# EAGLE design FlukeNic_UNITA (EAGLE 7.7.0)
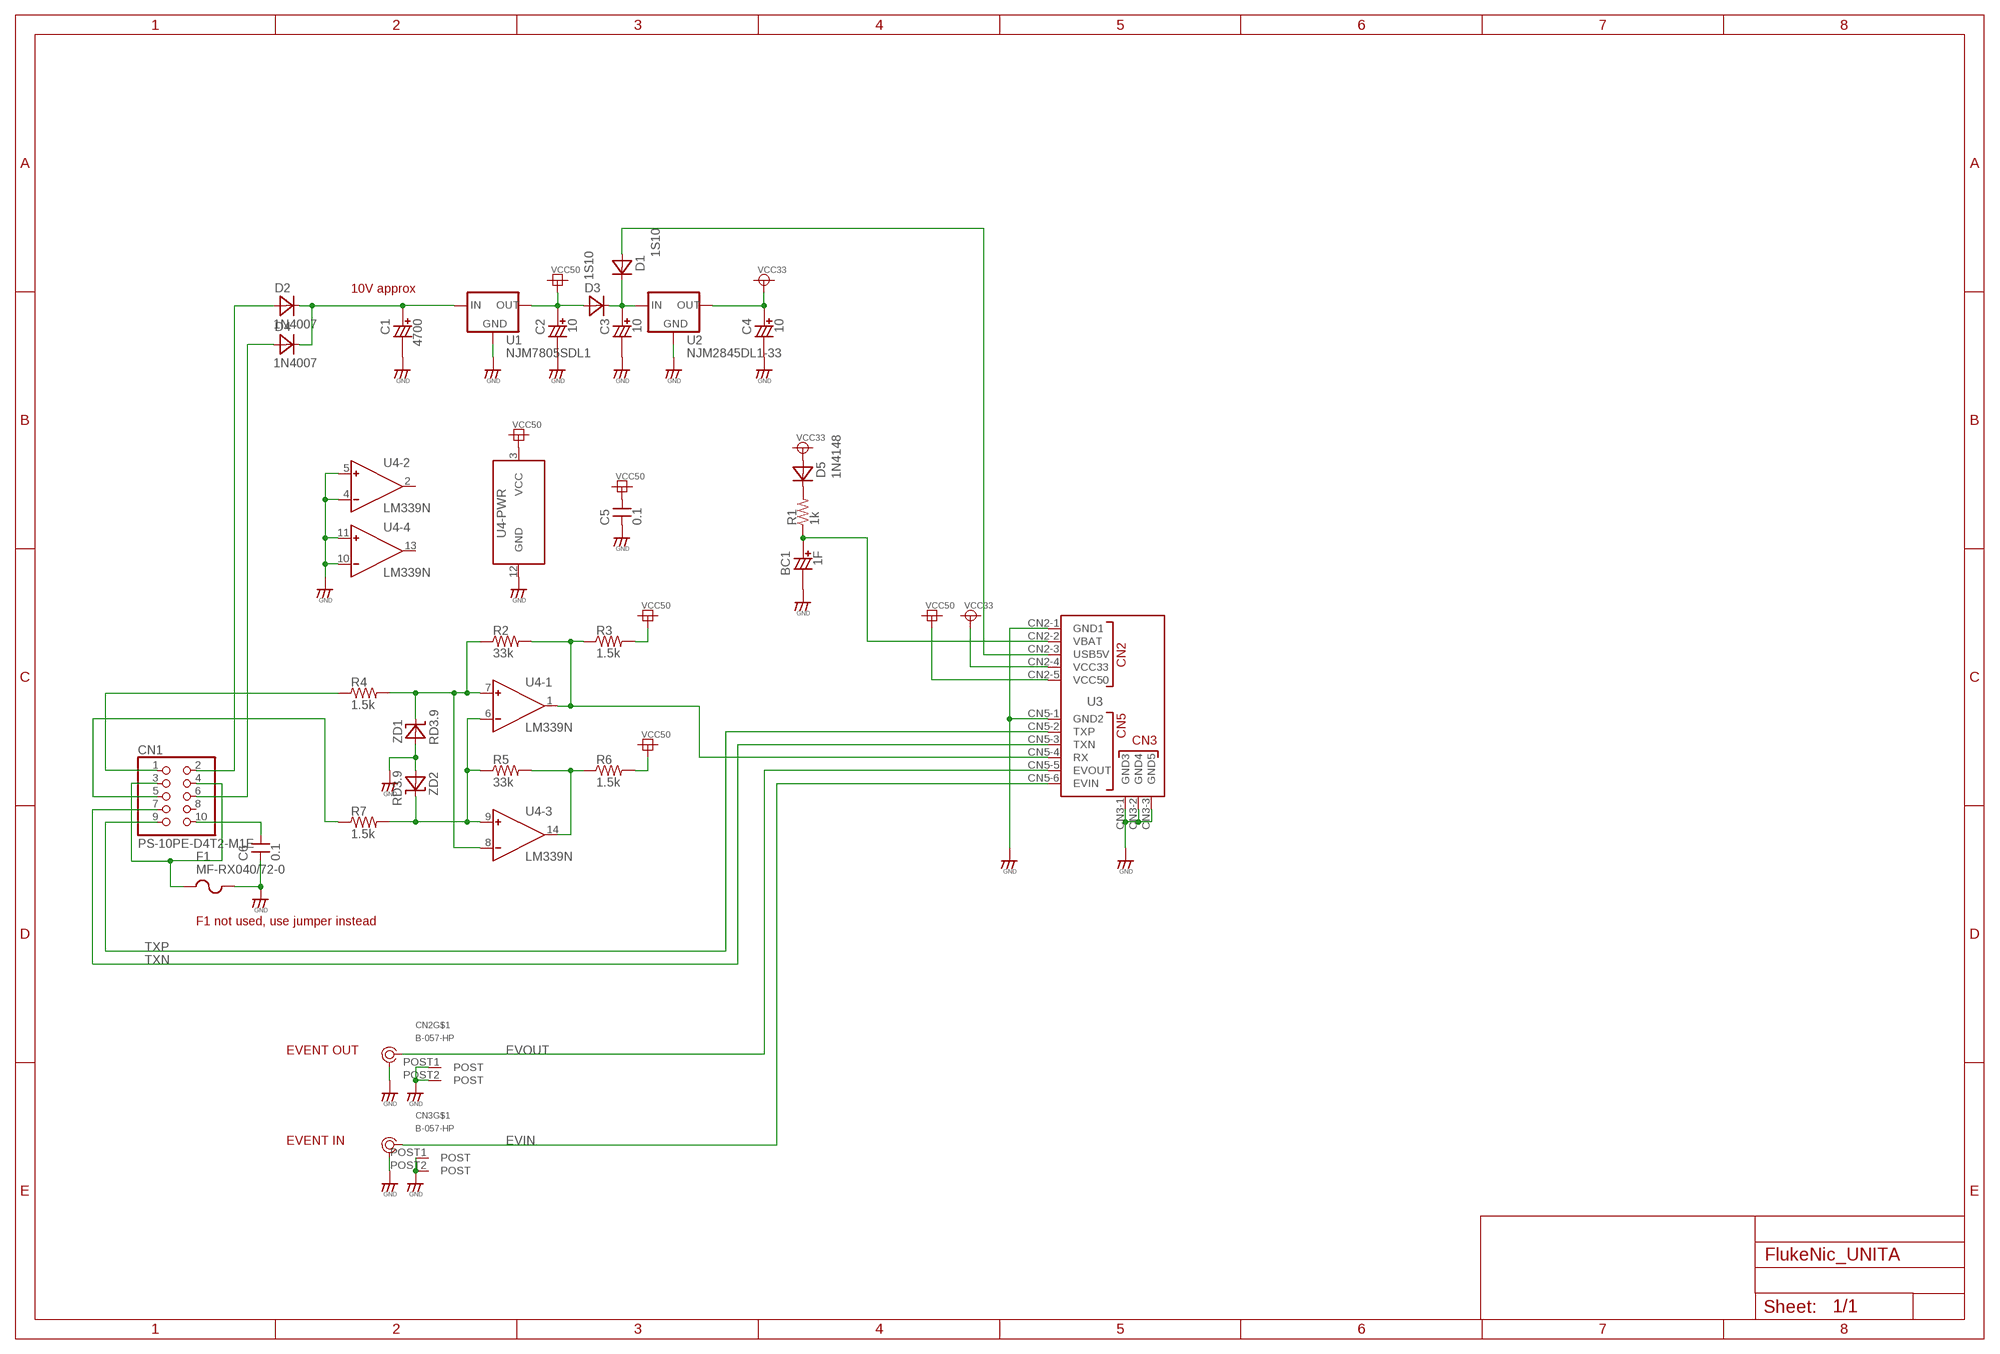
[diagram p0: schematic, sheet 1]

## Parts
BC1  1F  EDLCSE-5R5-D105VY  [SE-5R5-D105VY]
C1  4700  CCAP16  [CCAP_16]
C2  10  CCAP6.5  [CCAP_6.5]
C3  10  CCAP6.5  [CCAP_6.5]
C4  10  CCAP6.5  [CCAP_6.5]
C5  0.1  CAPDIP_2  [CAP_DIP_2]
C6  0.1  CAPDIP_2  [CAP_DIP_2]
CN1  PS-10PE-D4T2-M1E  [PS-10PE-D4T2-M1E]
CN2  B-057-HP  [B-057-HP]
CN3  B-057-HP  [B-057-HP]
D1  1S10  DIODEGENERIC_4_1MM  [DIODE_4_1MM]
D2  1N4007  DIODEGENERIC_4_1MM  [DIODE_4_1MM]
D3  1S10  DIODEGENERIC_4_1MM  [DIODE_4_1MM]
D4  1N4007  DIODEGENERIC_4_1MM  [DIODE_4_1MM]
D5  1N4148  DIODEGENERIC_4  [DIODE_4]
F1  MF-RX040/72-0  POLYSW8X2MM  [AX_08X02_2P_200]
R1  1k  R0.25W_4P  [R_0.25W_4]
R2  33k  R0.25W_4P  [R_0.25W_4]
R3  1.5k  R0.25W_4P  [R_0.25W_4]
R4  1.5k  R0.25W_4P  [R_0.25W_4]
R5  33k  R0.25W_4P  [R_0.25W_4]
R6  1.5k  R0.25W_4P  [R_0.25W_4]
R7  1.5k  R0.25W_4P  [R_0.25W_4]
U1  NJM7805SDL1  78XXTO252  [TO252]
U2  NJM2845DL1-33  NJM2845  [TO252]
U3  UNITB  [UNITB]
U4  LM339N  [DIL14]
ZD1  RD3.9  ZENER_DIODE4  [DIODE_4]
ZD2  RD3.9  ZENER_DIODE4  [DIODE_4]

## Nets
EVIN: CN3.HOT U3.CN5-6(EVIN)
EVOUT: CN2.HOT U3.CN5-5(EVOUT)
GND: BC1.- C1.- C2.- C3.- C4.- C5.1 C6.1 CN2.COLD CN2.POST1(POST) CN2.POST2(POST) CN3.COLD CN3.POST1(POST) CN3.POST2(POST) F1.2 U1.2(GND) U2.2(GND) U3.CN2-1(GND1) U3.CN3-1(GND3) U3.CN3-2(GND4) U3.CN3-3(GND5) U3.CN5-1(GND2) U4.4(-2:IN-) U4.5(-2:IN+) U4.10(-4:IN-) U4.11(-4:IN+) U4.12(-PWR:GND) ZD1.A ZD2.A
N$2: R2.1 R4.2 U4.7(-1:IN+) U4.8(-3:IN-) ZD1.K
N$4: R5.1 R7.2 U4.6(-1:IN-) U4.9(-3:IN+) ZD2.K
N$6: R5.2 R6.1 U4.14(-3:OUT)
N$7: D5.K R1.2
N$9: CN1.3 CN1.4 F1.1
N$12: C1.+ D2.K D4.K U1.1(IN)
N$20: CN1.2 D2.A
N$21: CN1.6 D4.A
N$29: C3.+ D1.K D3.K U2.1(IN)
N$37: C6.2 CN1.10
RX: R2.2 R3.1 U3.CN5-4(RX) U4.1(-1:OUT)
RXN: CN1.5 R7.1
RXP: CN1.1 R4.1
TXN: CN1.7 U3.CN5-3(TXN)
TXP: CN1.9 U3.CN5-2(TXP)
USB5V: D1.A U3.CN2-3(USB5V)
VBAT: BC1.+ R1.1 U3.CN2-2(VBAT)
VCC33: C4.+ D5.A U2.3(OUT) U3.CN2-4(VCC33)
VCC50: C2.+ C5.2 D3.A R3.2 R6.2 U1.3(OUT) U3.CN2-5(VCC50) U4.3(-PWR:VCC)
Unconnected: CN1.8 U4.2(-2:OUT) U4.13(-4:OUT)

## Notes on the sheet
- 10V approx
- F1 not used, use jumper instead
- EVENT OUT
- EVENT IN

## Library data of the parts
BC1 = FlukeNic:EDLC
C1-C4 = FlukeNic:CCAP: Polar capacitor
C5 C6 = FlukeNic:CAP: Non polar capacitor
CN1 = FlukeNic:PS-10PE-D4T2-M1E
CN2 CN3 = FlukeNic:B-057-HP
D1-D5 = FlukeNic:DIODE
F1 = FlukeNic:POLYSW
R1-R7 = FlukeNic:R
U1 = FlukeNic:78XX
U2 = FlukeNic:NJM2845
U3 = FlukeNic:UNITB
U4 = FlukeNic:LM339
ZD1 ZD2 = FlukeNic:ZENER_DIODE

## Board
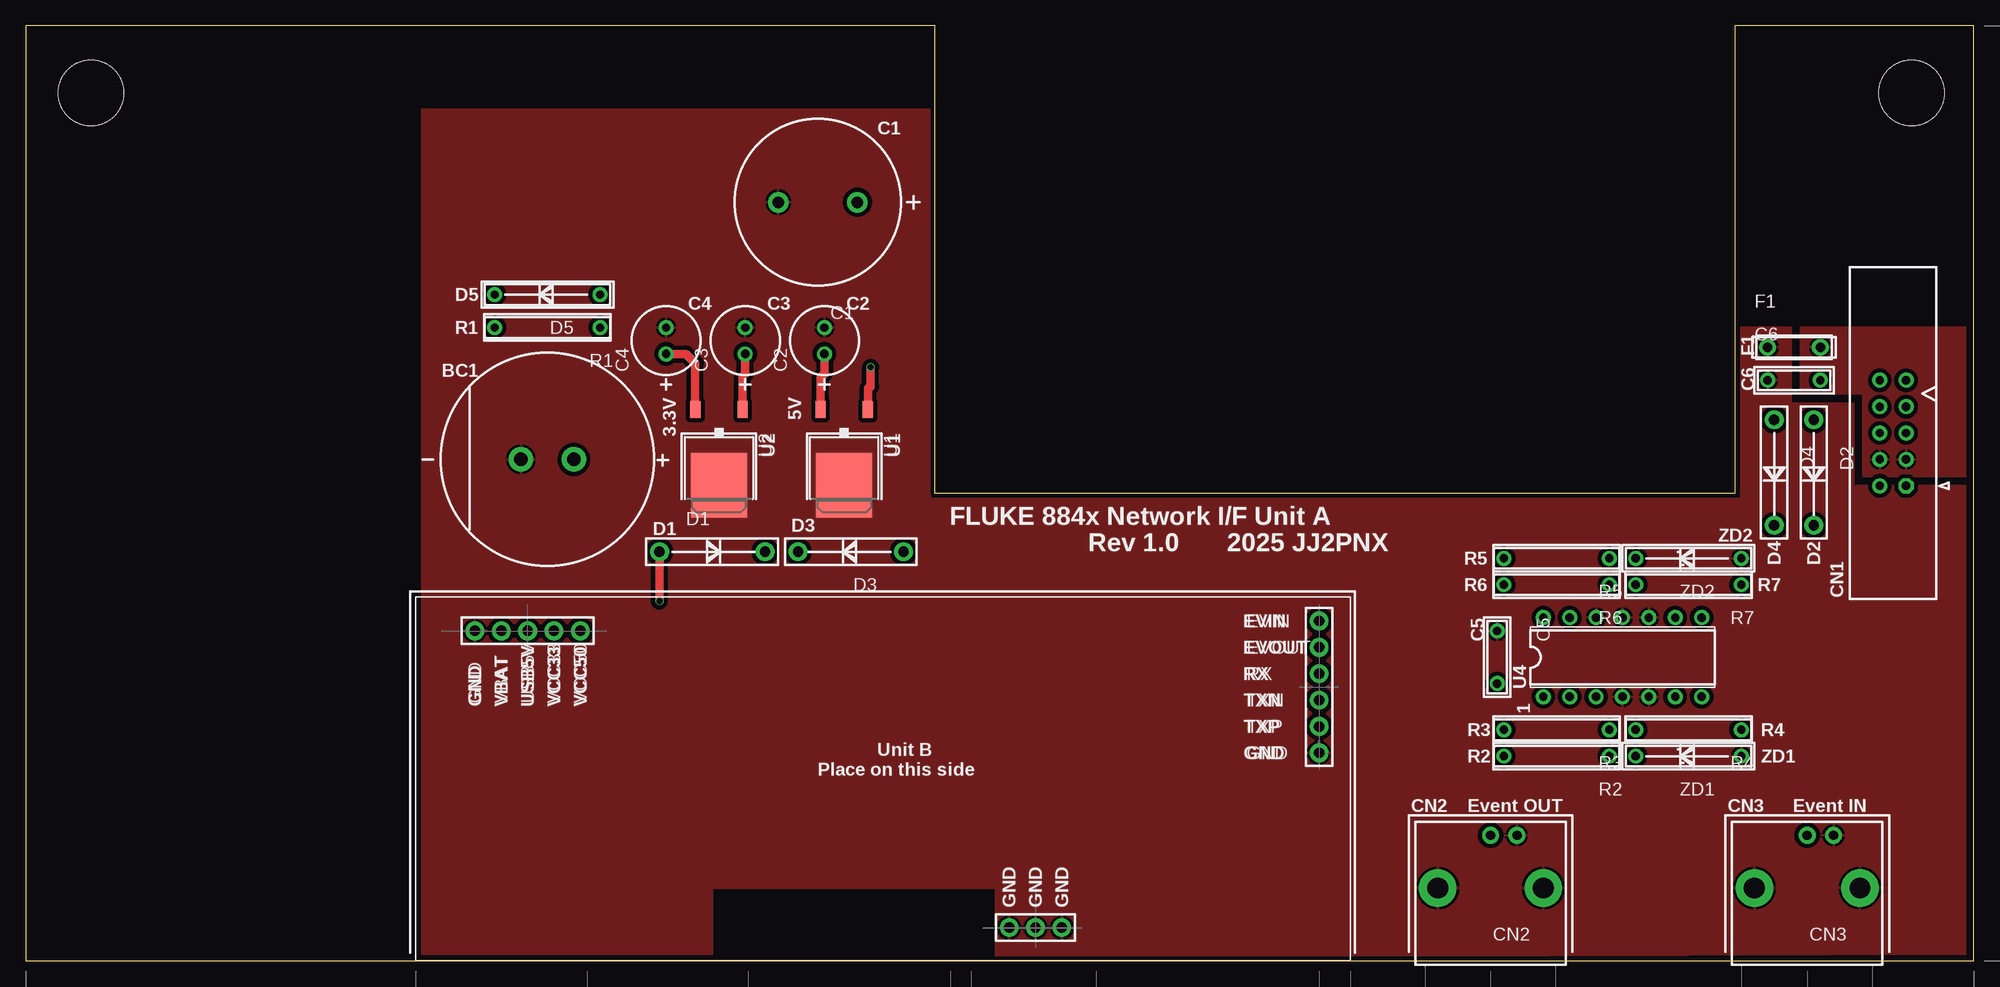
[diagram p1: board, top side]
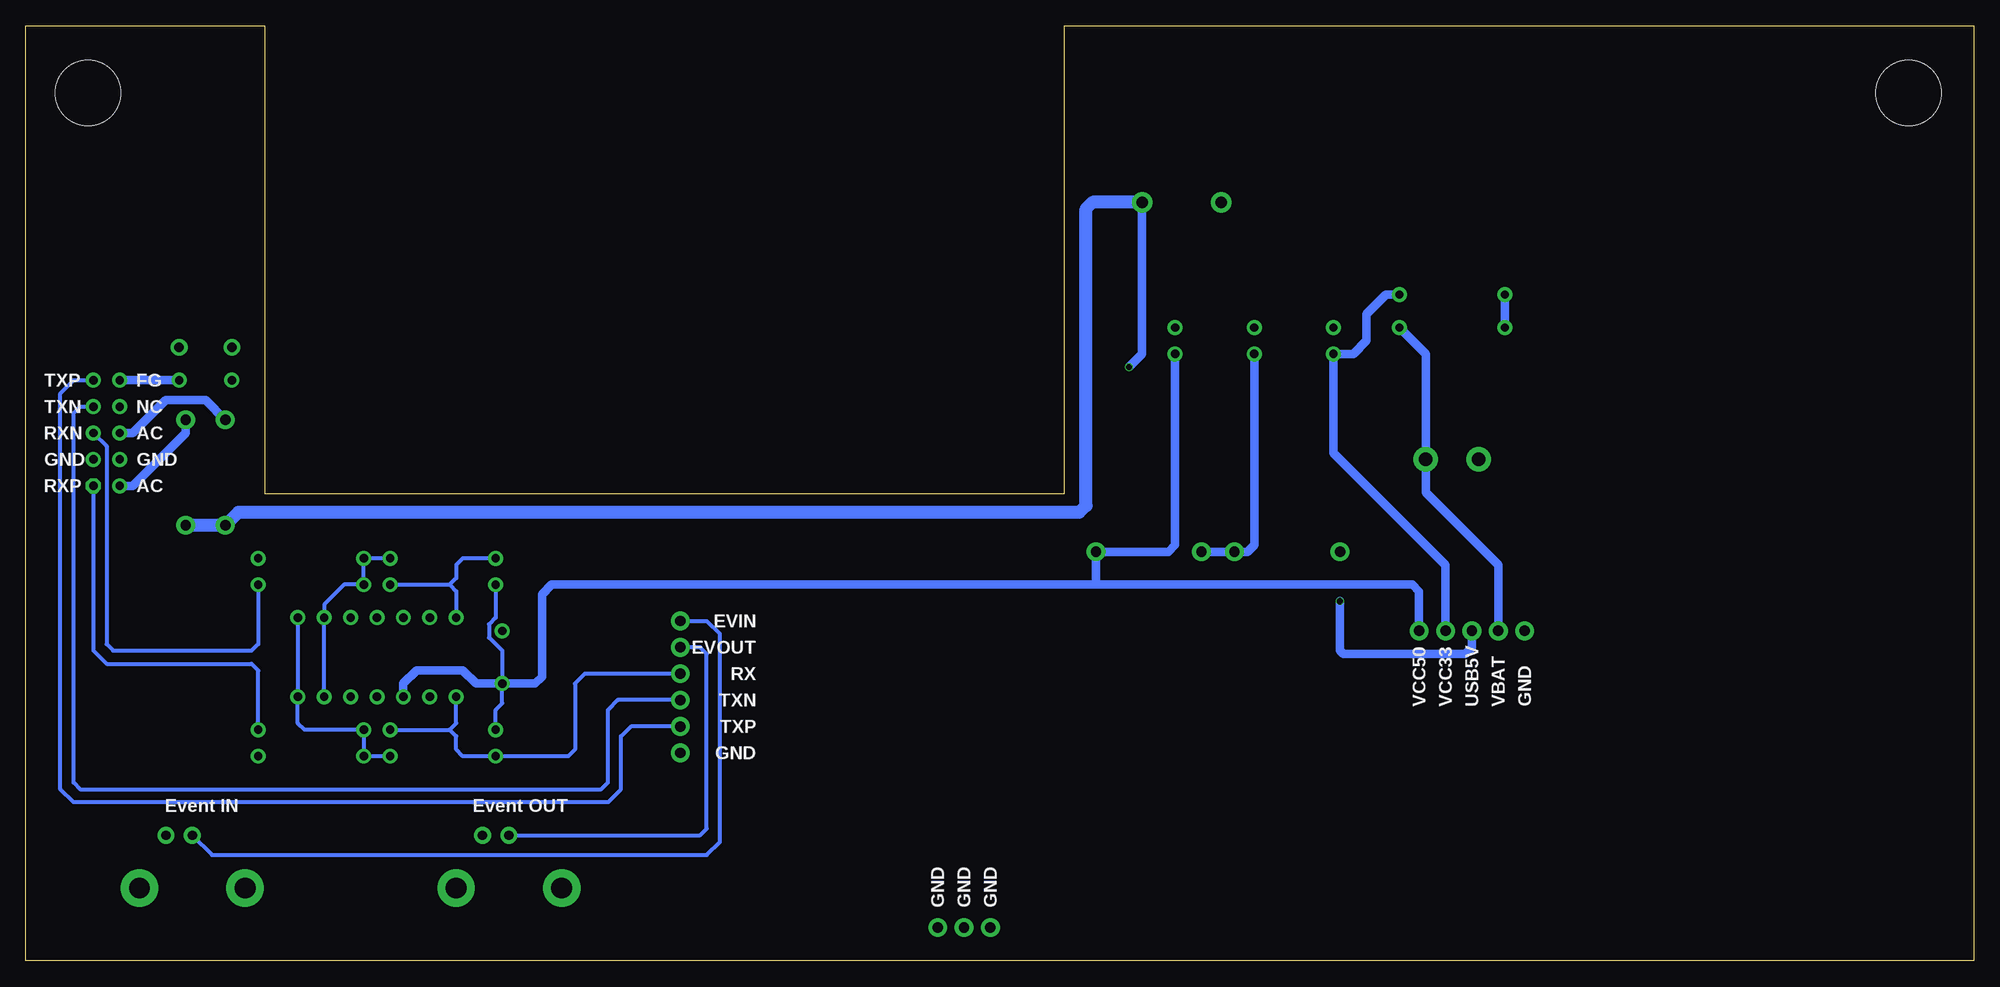
[diagram p2: board, bottom side, seen from below]

Size 187.5 x 90 mm. Coordinates in mm from the lower left corner, seen from the top.
Outline: 0,0 187.5,0 187.5,90 164.5,90 164.5,45 87.5,45 87.5,90 0,90 0,0
Copper layers (1*16): Top 0.035mm / dielectric 1.6mm / Bottom 0.035mm
Design rules "jlcpcb-2layers *": minimum track width 5mil, minimum drill 0.3mm, track to track 5mil, track to pad 5mil, pad to pad 5mil, via to via 5mil, smd to smd 5mil, copper to edge 0.2mm, drill to drill 6mil, minimum pad ring 10mil, minimum via ring 3mil, stop-mask expansion 4mil, vias tented up to drill 0mil, thermal gap 10mil
Holes 6.3 mm at 181.52,83.57 6.26,83.57
bRestrict: area 67.5,0 to 91,8.5

### Footprints (pad centres in the part's own frame; a part is rotated, then mirrored left to right if it is on the bottom)
SE-5R5-D105VY = drill 1.3: + -2.54,0; - 2.54,0
CCAP_16 = drill 1.1: + -3.81,0; - 3.81,0
CCAP_6.5 = drill 0.8: + -1.27,0; - 1.27,0
CAP_DIP_2 = drill 0.8: 1 -2.54,0; 2 2.54,0
PS-10PE-D4T2-M1E = drill 0.8 octagon: 1 5.08,1.27 | drill 0.8: 2 5.08,-1.27; 3 2.54,1.27; 4 2.54,-1.27; 5 0,1.27; 6 0,-1.27; 7 -2.54,1.27; 8 -2.54,-1.27; 9 -5.08,1.27; 10 -5.08,-1.27
B-057-HP = drill 0.9: COLD -2.54,-5.08; HOT 0,-5.08 | drill 2: POST1 -5.08,0; POST2 5.08,0
DIODE_4_1MM = drill 1: A -5.08,0; K 5.08,0
DIODE_4 = drill 0.8: A -5.08,0; K 5.08,0
AX_08X02_2P_200 = drill 0.9: 1 2.54,0; 2 -2.54,0
R_0.25W_4 = drill 0.8: 1 -5.08,0; 2 5.08,0
TO252 = smd 1 x 1.6: 1 -2.28,-4.8; 3 2.28,-4.8 | smd 5.4 x 6.2: 2 0,2.5
UNITB = drill 1: CN2-1 5.715,31.75; CN2-2 8.255,31.75; CN2-3 10.795,31.75; CN2-4 13.335,31.75; CN2-5 15.875,31.75; CN3-1 57.15,3.175; CN3-2 59.69,3.175; CN3-3 62.23,3.175; CN5-1 86.995,20.003; CN5-2 86.995,22.543; CN5-3 86.995,25.082; CN5-4 86.995,27.622; CN5-5 86.995,30.163; CN5-6 86.995,32.703
DIL14 = drill 0.8: 1 -7.62,-3.81; 2 -5.08,-3.81; 3 -2.54,-3.81; 4 0,-3.81; 5 2.54,-3.81; 6 5.08,-3.81; 7 7.62,-3.81; 8 7.62,3.81; 9 5.08,3.81; 10 2.54,3.81; 11 0,3.81; 12 -2.54,3.81; 13 -5.08,3.81; 14 -7.62,3.81

### Placement (x,y rotation side)
BC1  50.2,48.26 180 top
C1  76.23,73.03 180 top
C2  76.87,59.69 90 top
C3  69.25,59.69 90 top
C4  61.63,59.69 90 top
C5  141.64,29.21 270 top
C6  170.22,55.88 0 top
CN1  179.74,50.8 270 top
CN2  141,6.99 180 top
CN3  171.49,6.99 180 top
D1  66.08,39.37 0 top
D2  172.12,46.99 270 top
D3  79.41,39.37 180 top
D4  168.31,46.99 270 top
D5  50.2,64.14 180 top
F1  170.22,59.05 0 top
R1  50.2,60.96 180 top
R2  147.36,19.68 180 top
R3  147.36,22.23 180 top
R4  160.06,22.23 180 top
R5  147.36,38.73 180 top
R6  147.36,36.2 180 top
R7  160.06,36.2 180 top
U1  78.78,48.26 180 top
U2  66.71,48.26 180 top
U3  37.5,0 0 top
U4  153.7,29.21 0 top
ZD1  160.06,19.68 180 top
ZD2  160.06,38.73 180 top

### Tracks (layer width: path | path; a pad name or v marks a point on that pad's centre or on a via)
EVIN
  Bottom 0.406: CN3.HOT 169.58,10.16 121.95,10.16 120.69,11.43 120.69,31.43 121.95,32.7 U3.CN5-6
EVOUT
  Bottom 0.406: CN2.HOT 122.59,12.06 121.95,12.7 121.95,29.53 122.59,30.16 U3.CN5-5
GND
  pour Top (isolate 0.406): 38.13,81.92 87.03,81.92 87.03,44.45 165.13,44.45 165.13,60.96 169.9,60.96 169.9,53.66 175.93,53.66 175.93,45.72 186.72,45.72 186.72,0.64 93.38,0.32 93.38,6.99 66.08,6.99 66.08,0.64 38.13,0.64
  pour Top (no thermals): 62.9,49.53 62.9,41.91 70.52,41.91 70.52,49.53
  pour Top (no thermals): 74.97,41.91 82.59,41.91 82.59,49.53 74.97,49.53
N$2
  Bottom 0.406: U4.8 U4.7 161.32,22.86 160.69,22.23 R4.2 ZD1.K R2.1
N$4
  Bottom 0.406: U4.6 U4.9 158.78,34.29 156.88,36.2 R7.2 ZD2.K R5.1
N$6
  Bottom 0.406: R6.1 146.72,36.2 | R5.2 145.45,38.73 146.08,38.1 146.08,36.83 146.72,36.2 | 146.72,36.2 146.08,35.56 U4.14
N$7
  Bottom 0.813: D5.K R1.2
N$9
  pour Top (isolate 0.406): 170.85,60.96 170.85,54.61 176.88,54.61 176.88,46.67 186.72,46.67 186.72,60.96
N$12  (via drill 0.6)
  Top 0.813: U1.1 81.06,54.98 arc-90 81.31,55.24 v81.31,57.15
  Bottom 0.813: v81.31,57.15 80.05,58.42 C1.+
  Bottom 1.27: D2.K D4.K 167.04,43.18 86.08,43.18 85.44,43.81 85.44,72.39 84.81,73.03 C1.+
N$20
  Bottom 0.813: CN1.2 177.2,45.72 172.12,50.8 D2.A
N$21
  Bottom 0.813: D4.A 170.22,53.98 174.03,53.98 177.2,50.8 CN1.6
N$29
  Top 0.813: U2.1 68.99,56.26 69.25,56.52 C3.+
  Bottom 0.813: D3.K D1.K 69.88,39.37 69.25,40.01 C3.+
N$37
  Bottom 0.813: CN1.10 C6.2
RX
  Bottom 0.406: U3.CN5-4 133.7,27.62 134.66,26.67 134.66,20.32 135.29,19.68 R2.2 145.45,19.68 146.08,20.32 146.08,21.59 146.72,22.23 | R3.1 146.72,22.23 | 146.72,22.23 146.08,22.86 U4.1
RXN
  Bottom 0.406: CN1.5 179.74,49.53 179.74,30.48 179.1,29.84 165.77,29.84 165.13,30.48 R7.1
RXP
  Bottom 0.406: CN1.1 181.01,29.84 179.74,28.57 165.77,28.57 165.13,27.94 R4.1
TXN
  Bottom 0.406: CN1.7 182.28,53.34 182.91,52.7 182.91,17.14 182.28,16.51 132.12,16.51 131.48,17.14 131.48,24.13 130.53,25.08 U3.CN5-3
TXP
  Bottom 0.406: CN1.9 182.91,55.88 184.19,54.61 184.19,16.51 182.91,15.24 131.48,15.24 130.21,16.51 130.21,21.59 129.26,22.54 U3.CN5-2
USB5V  (via drill 0.6)
  Top 0.813: v61,34.61 D1.A
  Bottom 0.813: U3.CN2-3 48.3,30.16 48.93,29.53 60.68,29.53 61,29.84 v61,34.61
VBAT
  Bottom 0.813: R1.1 52.74,58.42 BC1.+ 52.74,45.09 45.76,38.1 U3.CN2-2
VCC33
  Top 0.813: C4.+ 63.53,58.42 64.43,57.52 U2.3
  Bottom 0.813: D5.A 56.55,64.14 58.45,62.23 58.45,59.69 59.73,58.42 C4.+ 61.63,48.9 50.84,38.1 U3.CN2-4
VCC50
  Top 0.813: U1.3 76.5,56.14 76.87,56.52 C2.+
  Bottom 0.406: R3.2 142.28,24.13 141.64,24.77 C5.2 141.64,29.84 142.91,31.11 142.91,32.38 142.28,33.02 R6.2
  Bottom 0.813: U4.3 151.17,26.67 149.89,27.94 145.45,27.94 144.18,26.67 C5.2 138.47,26.67 137.83,27.3 137.83,35.24 136.88,36.2 84.49,36.2 | C2.+ 76.87,40.01 77.5,39.37 D3.A 84.49,36.2 | 84.49,36.2 54.01,36.2 53.38,35.56 U3.CN2-5

### Text on the board
tDocu: Use layer 121,125 as Top Silk | Use layer 126 as Bottom Silk | 90 | 19.5 | 38.5 | OUT | IN | 37.5 | 150 | 63 | 84.5 | 96.5 | 133.5
_tPlace: EVIN | EVOUT | RX | GND | VBAT | USB5V | VCC33 | VCC50 | TXN | TXP | GND | GND | GND | GND
_tNames: C1 | D5 | C4 | C3 | C2 | R1 | F1 | C6 | BC1 | 5V | U2 | U1 | 3.3V | FLUKE 884x Network I/F Unit A | D1 | D3 | ZD2 | Rev 1.0 | 2025 JJ2PNX | R5 | D4 | D2 | R6 | R7 | CN1 | C5 | U4 | 1 | R3 | R4 | Unit B | R2 | ZD1 | Place on this side | CN2 | Event OUT | CN3 | Event IN
_bNames: FG | TXP | NC | TXN | AC | RXN | GND | GND | AC | RXP | EVIN | EVOUT | RX | TXN | GND | VBAT | USB5V | VCC33 | VCC50 | TXP | GND | Event OUT | Event IN | GND | GND | GND